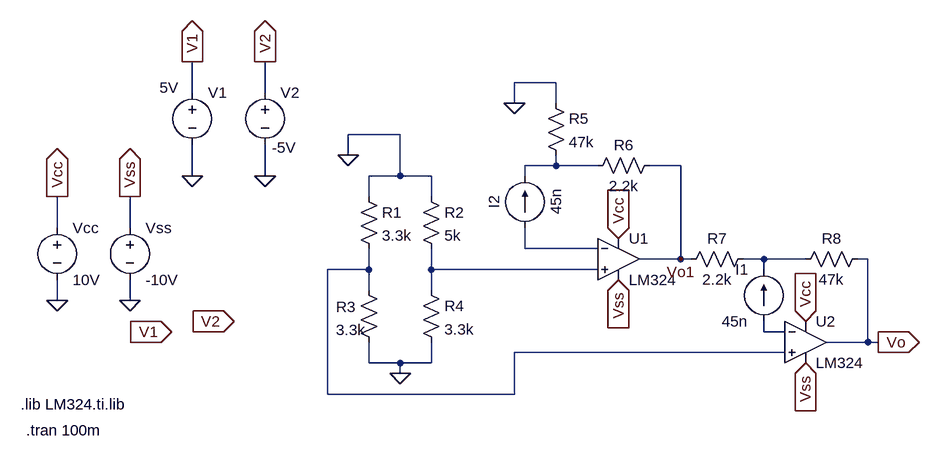
[diagram p0: schematic Circuito Adicional.asc]
Circuito Adicional.asc, the LTspice schematic file:
Version 4.1
SHEET 1 1316 680
WIRE 224 -336 160 -336
WIRE -336 -320 -336 -368
WIRE -224 -320 -224 -368
WIRE 160 -304 160 -336
WIRE 224 -304 224 -336
WIRE -16 -256 -96 -256
WIRE -96 -224 -96 -256
WIRE 224 -208 224 -224
WIRE 224 -208 176 -208
WIRE 288 -208 224 -208
WIRE 416 -208 368 -208
WIRE -336 -192 -336 -240
WIRE -224 -192 -224 -240
WIRE -16 -192 -16 -256
WIRE -16 -192 -64 -192
WIRE 32 -192 -16 -192
WIRE 176 -192 176 -208
WIRE -64 -160 -64 -192
WIRE 32 -160 32 -192
WIRE -544 -112 -544 -160
WIRE -432 -112 -432 -160
WIRE 176 -80 176 -112
WIRE 288 -80 176 -80
WIRE 416 -64 416 -208
WIRE 416 -64 352 -64
WIRE 432 -64 416 -64
WIRE 544 -64 512 -64
WIRE 608 -64 544 -64
WIRE 704 -64 688 -64
WIRE -64 -48 -64 -80
WIRE -64 -48 -128 -48
WIRE 32 -48 32 -80
WIRE 288 -48 32 -48
WIRE 544 -48 544 -64
WIRE -64 -16 -64 -48
WIRE 32 -16 32 -48
WIRE -544 0 -544 -32
WIRE -432 0 -432 -32
WIRE 544 48 544 32
WIRE 576 48 544 48
WIRE 704 64 704 -64
WIRE 704 64 640 64
WIRE 720 64 704 64
WIRE 576 80 160 80
WIRE -64 96 -64 64
WIRE -16 96 -64 96
WIRE 32 96 32 64
WIRE 32 96 -16 96
WIRE -16 112 -16 96
WIRE -128 144 -128 -48
WIRE 160 144 160 80
WIRE 160 144 -128 144
FLAG -368 48 V1
IOPIN -368 48 In
FLAG 320 -96 Vcc
IOPIN 320 -96 In
FLAG 608 32 Vcc
IOPIN 608 32 In
FLAG 608 96 Vss
IOPIN 608 96 In
FLAG 320 -32 Vss
IOPIN 320 -32 In
FLAG 720 64 Vo
IOPIN 720 64 Out
FLAG -544 0 0
FLAG -432 0 0
FLAG -544 -160 Vcc
IOPIN -544 -160 Out
FLAG -432 -160 Vss
IOPIN -432 -160 Out
FLAG -336 -368 V1
IOPIN -336 -368 Out
FLAG -224 -368 V2
IOPIN -224 -368 Out
FLAG -336 -192 0
FLAG -224 -192 0
FLAG -272 32 V2
IOPIN -272 32 In
FLAG 160 -304 0
FLAG 416 -64 Vo1
FLAG -96 -224 0
FLAG -16 112 0
SYMBOL OpAmps\\opamp2 320 -128 R0
SYMATTR InstName U1
SYMATTR Value LM324
SYMBOL OpAmps\\opamp2 608 0 R0
SYMATTR InstName U2
SYMATTR Value LM324
SYMBOL voltage -544 -128 R0
SYMATTR InstName Vcc
SYMATTR Value 10V
SYMBOL voltage -432 -128 R0
SYMATTR InstName Vss
SYMATTR Value -10V
SYMBOL voltage -336 -336 R0
WINDOW 3 -50 8 Left 2
WINDOW 123 0 0 Left 0
WINDOW 39 0 0 Left 0
SYMATTR Value 5V
SYMATTR InstName V1
SYMBOL voltage -224 -336 R0
WINDOW 3 11 100 Left 2
WINDOW 123 0 0 Left 0
WINDOW 39 0 0 Left 0
SYMATTR Value -5V
SYMATTR InstName V2
SYMBOL res -80 -176 R0
SYMATTR InstName R1
SYMATTR Value 3.3k
SYMBOL res 16 -176 R0
SYMATTR InstName R2
SYMATTR Value 5k
SYMBOL res -80 -32 R0
WINDOW 0 -35 42 Left 2
WINDOW 3 -35 77 Left 2
SYMATTR InstName R3
SYMATTR Value 3.3k
SYMBOL res 16 -32 R0
SYMATTR InstName R4
SYMATTR Value 3.3k
SYMBOL res 208 -320 R0
SYMATTR InstName R5
SYMATTR Value 47k
SYMBOL res 384 -224 R90
WINDOW 0 0 56 VBottom 2
WINDOW 3 32 56 VTop 2
SYMATTR InstName R6
SYMATTR Value 2.2k
SYMBOL res 528 -80 R90
WINDOW 0 0 56 VBottom 2
WINDOW 3 32 56 VTop 2
SYMATTR InstName R7
SYMATTR Value 2.2k
SYMBOL res 704 -80 R90
WINDOW 0 0 56 VBottom 2
WINDOW 3 32 56 VTop 2
SYMATTR InstName R8
SYMATTR Value 47k
SYMBOL current 544 32 R180
WINDOW 0 24 80 Left 2
WINDOW 3 24 0 Left 2
SYMATTR InstName I1
SYMATTR Value 45n
SYMBOL current 176 -112 R180
WINDOW 0 32 40 VTop 2
WINDOW 3 -32 40 VBottom 2
WINDOW 123 0 0 Left 0
WINDOW 39 0 0 Left 0
SYMATTR InstName I2
SYMATTR Value 45n
TEXT -600 160 Left 2 !.lib LM324.ti.lib
TEXT -592 200 Left 2 !.tran 100m

The netlist it stands for:
* Circuito Adicional.asc
X§U1 N005 N002 Vcc Vss Vo1 LM324  ; pins In+ In- V+ V- OUT
X§U2 N004 N006 Vcc Vss Vo LM324  ; pins In+ In- V+ V- OUT
Vcc Vcc 0 10V
Vss Vss 0 -10V
V1 V1 0 5V
V2 V2 0 -5V
R1 0 N004 3.3k
R2 0 N005 5k
R3 N004 0 3.3k
R4 N005 0 3.3k
R5 0 N001 47k
R6 Vo1 N001 2.2k
R7 N003 Vo1 2.2k
R8 Vo N003 47k
I1 N006 N003 45n
I2 N002 N001 45n
.lib LM324.ti.lib
.tran 100m
.backanno
.end